# Altium schematic sheet USB2.0_Hub.SchDoc
size A3; SheetNumber: 1; SheetTotal: 4
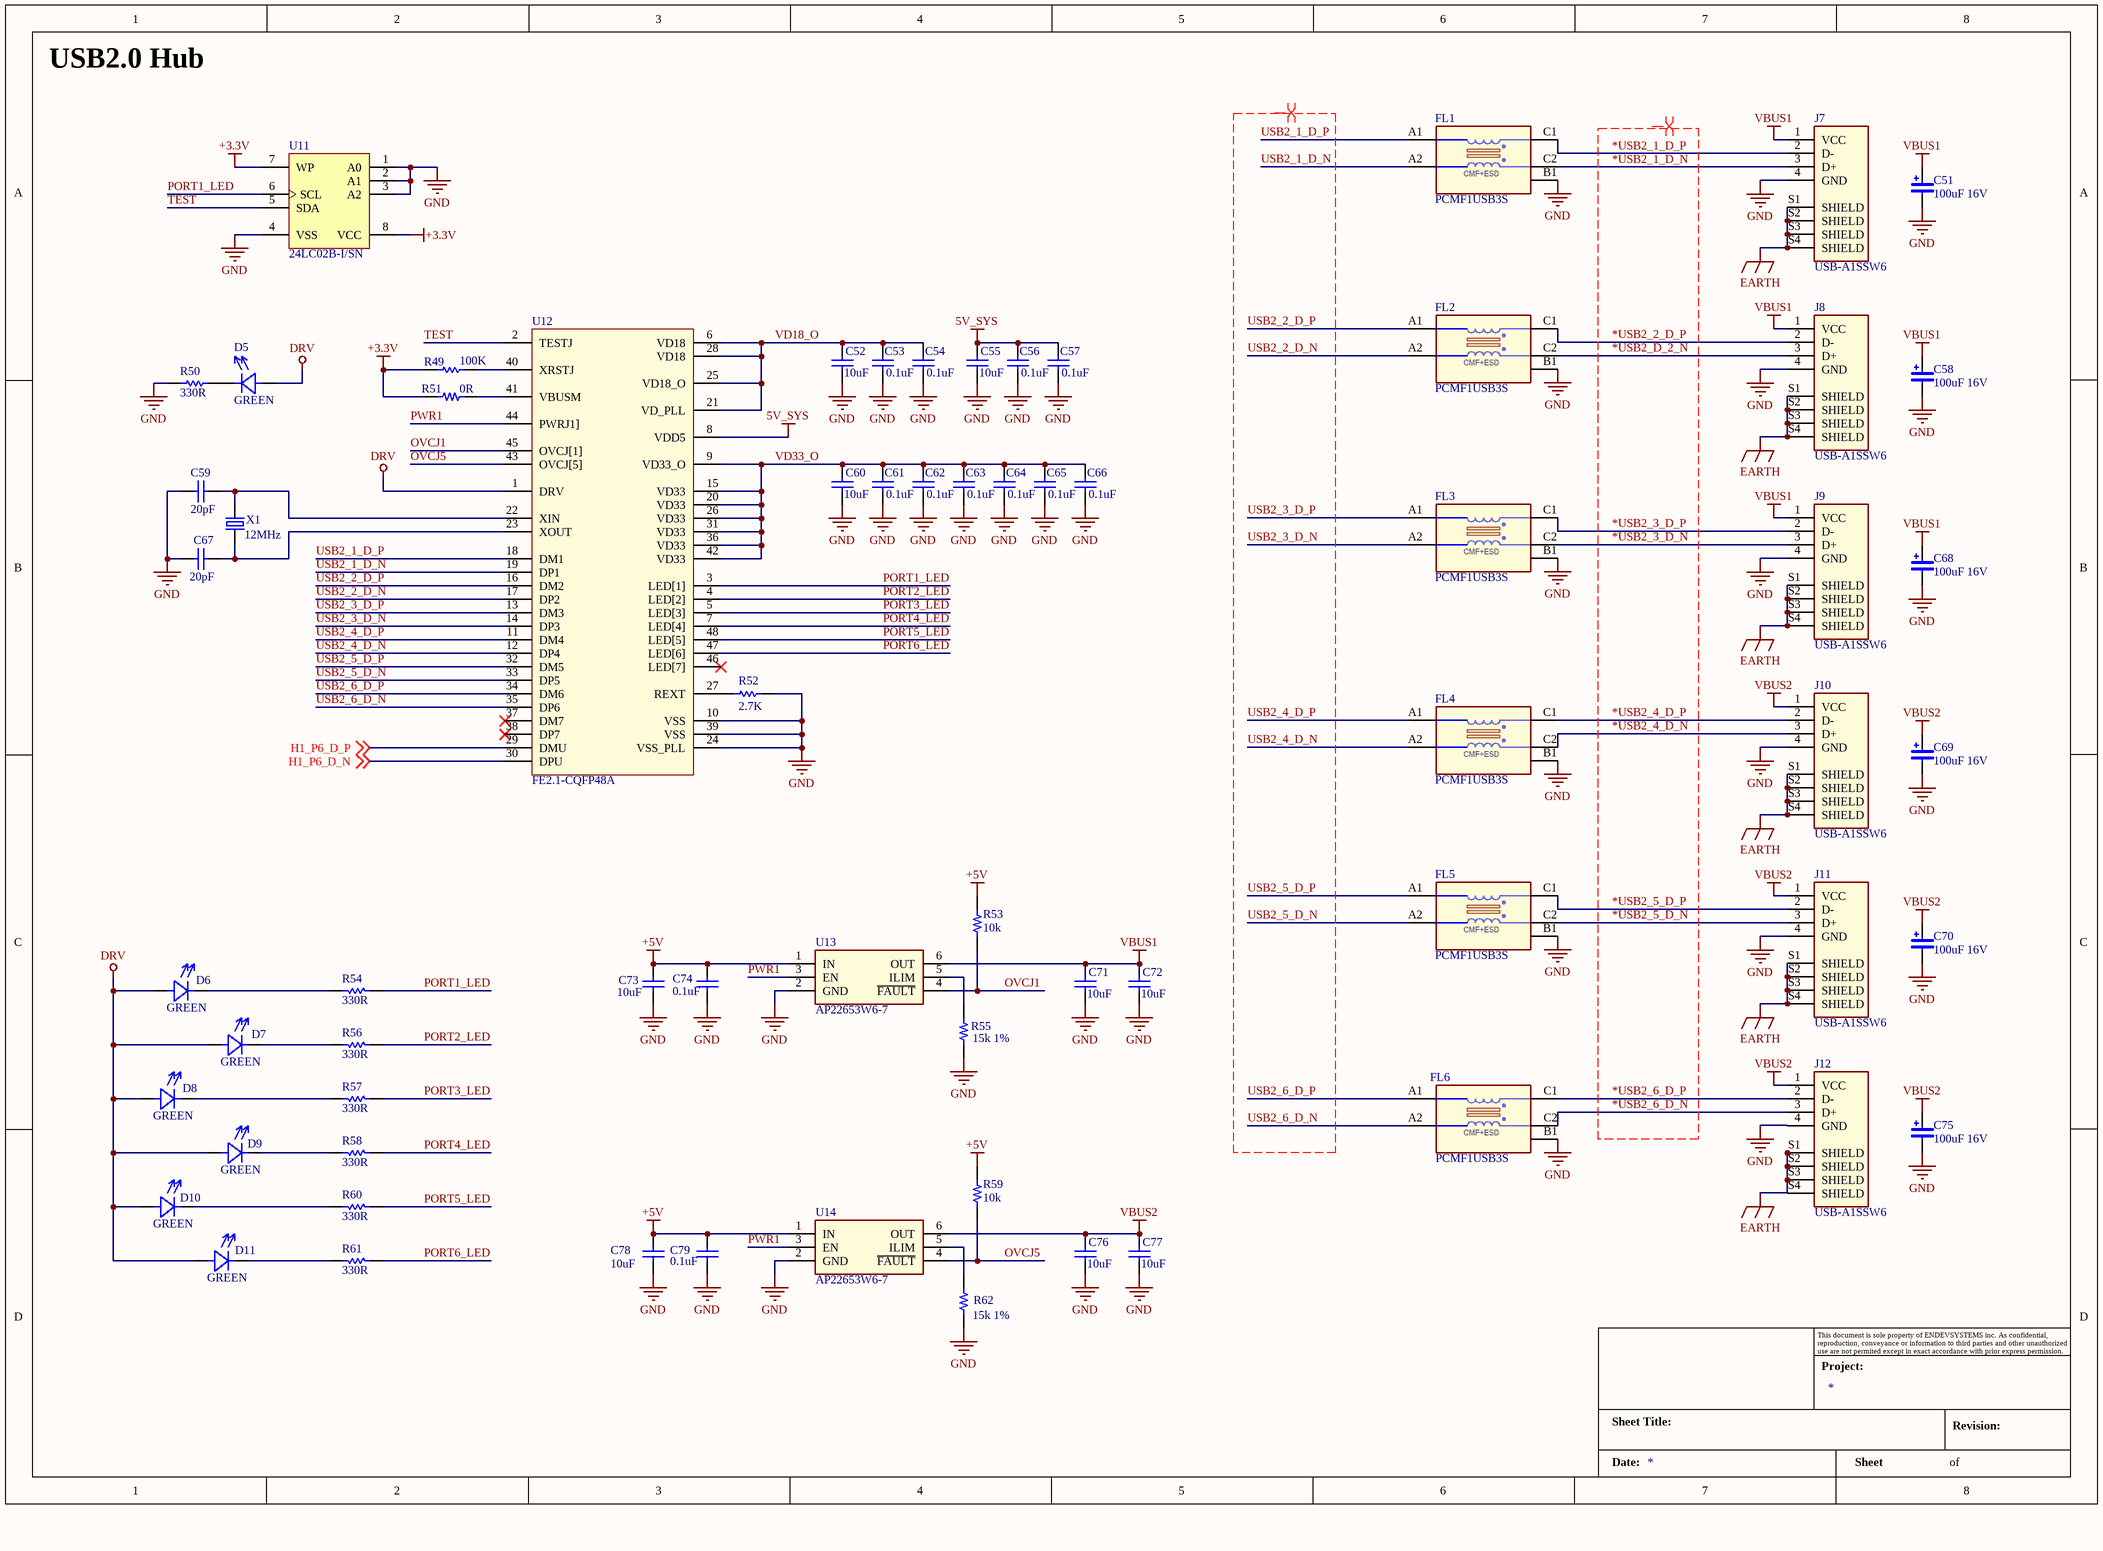
[diagram p0: USB2.0_Hub.SchDoc]

## Parts
?  Title_Block  (value not drawn)  (graphical)
C51  100uF 16V  [CAP-TAN-2312]
C52  10uF  [C-0805/2012]
C53  0.1uF  [C-0402/1005]
C54  0.1uF  [C-0402/1005]
C55  10uF  [C-0805/2012]
C56  0.1uF  [C-0402/1005]
C57  0.1uF  [C-0402/1005]
C58  100uF 16V  [CAP-TAN-2312]
C59  20pF  [R-0402/1005]
C60  10uF  [C-0805/2012]
C61  0.1uF  [C-0402/1005]
C62  0.1uF  [C-0402/1005]
C63  0.1uF  [C-0402/1005]
C64  0.1uF  [C-0402/1005]
C65  0.1uF  [C-0402/1005]
C66  0.1uF  [C-0402/1005]
C67  20pF  [R-0402/1005]
C68  100uF 16V  [CAP-TAN-2312]
C69  100uF 16V  [CAP-TAN-2312]
C70  100uF 16V  [CAP-TAN-2312]
C71  10uF  [C-0805/2012]
C72  10uF  [C-0805/2012]
C73  10uF  [C-0805/2012]
C74  0.1uF  [C-0402/1005]
C75  100uF 16V  [CAP-TAN-2312]
C76  10uF  [C-0805/2012]
C77  10uF  [C-0805/2012]
C78  10uF  [C-0805/2012]
C79  0.1uF  [C-0402/1005]
D5  GREEN  [LEDC1608X65N]
D6  GREEN  [LEDC1608X65N]
D7  GREEN  [LEDC1608X65N]
D8  GREEN  [LEDC1608X65N]
D9  GREEN  [LEDC1608X65N]
D10  GREEN  [LEDC1608X65N]
D11  GREEN  [LEDC1608X65N]
FL1  PCMF1USB3S  [WLCSP5(2-1-2)_NEX]
FL2  PCMF1USB3S  [WLCSP5(2-1-2)_NEX]
FL3  PCMF1USB3S  [WLCSP5(2-1-2)_NEX]
FL4  PCMF1USB3S  [WLCSP5(2-1-2)_NEX]
FL5  PCMF1USB3S  [WLCSP5(2-1-2)_NEX]
FL6  PCMF1USB3S  [WLCSP5(2-1-2)_NEX]
J7  USB-A1SSW6  [ONSHORE_USB-A1SSW6]
J8  USB-A1SSW6  [ONSHORE_USB-A1SSW6]
J9  USB-A1SSW6  [ONSHORE_USB-A1SSW6]
J10  USB-A1SSW6  [ONSHORE_USB-A1SSW6]
J11  USB-A1SSW6  [ONSHORE_USB-A1SSW6]
J12  USB-A1SSW6  [ONSHORE_USB-A1SSW6]
R49  100K  [R-0402/1005]
R50  330R  [R-0402/1005]
R51  0R  [R-0402/1005]
R52  value 2.7K  [R-0402/1005]
R53  10k  [R-0402/1005]
R54  330R  [R-0402/1005]
R55  15k 1%  [R-0402/1005]
R56  330R  [R-0402/1005]
R57  330R  [R-0402/1005]
R58  330R  [R-0402/1005]
R59  10k  [R-0402/1005]
R60  330R  [R-0402/1005]
R61  330R  [R-0402/1005]
R62  15k 1%  [R-0402/1005]
U11  24LC02B-I/SN  [SOIC-SN8_N]
U12  FE2.1-CQFP48A  [PCBComponent_1]
U13  AP22653W6-7  [SOT-23-6]
U14  AP22653W6-7  [SOT-23-6]
X1  12MHz  [HC-49/US]

## Nets
5V_SYS: C55.2 C56.2 C57.2 U12.8(VDD5)
+3.3V: R49.1 R51.1 U11.7(WP) U11.8(VCC)
+5V: C73.2 C74.2 C78.2 C79.2 R53.1 R59.1 U13.1(IN) U14.1(IN)
DRV: D5.A D6.A D7.A D8.A D9.A D10.A D11.A U12.1(DRV)
EARTH: J7.S1(SHIELD) J7.S2(SHIELD) J7.S3(SHIELD) J7.S4(SHIELD) J8.S1(SHIELD) J8.S2(SHIELD) J8.S3(SHIELD) J8.S4(SHIELD) J9.S1(SHIELD) J9.S2(SHIELD) J9.S3(SHIELD) J9.S4(SHIELD) J10.S1(SHIELD) J10.S2(SHIELD) J10.S3(SHIELD) J10.S4(SHIELD) J11.S1(SHIELD) J11.S2(SHIELD) J11.S3(SHIELD) J11.S4(SHIELD) J12.S1(SHIELD) J12.S2(SHIELD) J12.S3(SHIELD)
GND: C51.- C52.1 C53.1 C54.1 C55.1 C56.1 C57.1 C58.- C59.2 C60.1 C61.1 C62.1 C63.1 C64.1 C65.1 C66.1 C67.2 C68.- C69.- C70.- C71.1 C72.1 C73.1 C74.1 C75.- C76.1 C77.1 C78.1 C79.1 FL1.B1(GND) FL2.B1(GND) FL3.B1(GND) FL4.B1(GND) FL5.B1(GND) FL6.B1(GND) J7.4(GND) J8.4(GND) J9.4(GND) J10.4(GND) J11.4(GND) R50.1 R52.2 R55.1 R62.1 U11.1(A0) U11.2(A1) U11.3(A2) U11.4(VSS) U12.10(VSS) U12.24(VSS_PLL) U12.39(VSS) U13.2(GND) U14.2(GND)
VBUS1: C51.+ C58.+ C68.+ C71.2 C72.2 J7.1(VCC) J8.1(VCC) J9.1(VCC) U13.6(OUT)
VBUS2: C69.+ C70.+ C75.+ C76.2 C77.2 J10.1(VCC) J11.1(VCC) J12.1(VCC) U14.6(OUT)
*USB2_2_D_P: FL2.C1(CH1_OUT+) J8.2(D-)
*USB2_3_D_N: FL3.C2(CH1_OUT-) J9.3(D+)
*USB2_3_D_P: FL3.C1(CH1_OUT+) J9.2(D-)
*USB2_4_D_N: FL4.C2(CH1_OUT-) J10.3(D+)
*USB2_4_D_P: FL4.C1(CH1_OUT+) J10.2(D-)
*USB2_5_D_N: FL5.C2(CH1_OUT-) J11.3(D+)
*USB2_5_D_P: FL5.C1(CH1_OUT+) J11.2(D-)
*USB2_6_D_N: FL6.C2(CH1_OUT-) J12.3(D+)
*USB2_6_D_P: FL6.C1(CH1_OUT+) J12.2(D-)
*USB2_D_2_N: FL2.C2(CH1_OUT-) J8.3(D+)
H1_P6_D_N: U12.30(DPU) ; off-sheet H1_P6_D_N
H1_P6_D_P: U12.29(DMU) ; off-sheet H1_P6_D_P
OVCJ1: R53.2 U12.45(OVCJ[1]) U13.4(~{FAULT})
OVCJ5: R59.2 U12.43(OVCJ[5]) U14.4(~{FAULT})
PORT1_LED: R54.1 U11.6(SCL) U12.3(LED[1])
PORT2_LED: R56.1 U12.4(LED[2])
PORT3_LED: R57.1 U12.5(LED[3])
PORT4_LED: R58.1 U12.7(LED[4])
PORT5_LED: R60.1 U12.48(LED[5])
PORT6_LED: R61.1 U12.47(LED[6])
PWR1: U12.44(PWRJ1]) U13.3(EN) U14.3(EN)
TEST: U11.5(SDA) U12.2(TESTJ)
USB2_1_D_N: FL1.A2(CH1_IN-) U12.19(DP1)
USB2_1_D_P: FL1.A1(CH1_IN+) U12.18(DM1)
USB2_2_D_N: FL2.A2(CH1_IN-) U12.17(DP2)
USB2_2_D_P: FL2.A1(CH1_IN+) U12.16(DM2)
USB2_3_D_N: FL3.A2(CH1_IN-) U12.14(DP3)
USB2_3_D_P: FL3.A1(CH1_IN+) U12.13(DM3)
USB2_4_D_N: FL4.A2(CH1_IN-) U12.12(DP4)
USB2_4_D_P: FL4.A1(CH1_IN+) U12.11(DM4)
USB2_5_D_N: FL5.A2(CH1_IN-) U12.33(DP5)
USB2_5_D_P: FL5.A1(CH1_IN+) U12.32(DM5)
USB2_6_D_N: FL6.A2(CH1_IN-) U12.35(DP6)
USB2_6_D_P: FL6.A1(CH1_IN+) U12.34(DM6)
VD18_O: C52.2 C53.2 C54.2 U12.6(VD18) U12.21(VD_PLL) U12.25(VD18_O) U12.28(VD18)
VD33_O: C60.2 C61.2 C62.2 C63.2 C64.2 C65.2 C66.2 U12.9(VD33_O) U12.15(VD33) U12.20(VD33) U12.26(VD33) U12.31(VD33) U12.36(VD33) U12.42(VD33)
NetC59_1: C59.1 U12.22(XIN) X1.2
NetC67_1: C67.1 U12.23(XOUT) X1.1
NetD5_C: D5.C R50.2
NetD6_C: D6.C R54.2
NetD7_C: D7.C R56.2
NetD8_C: D8.C R57.2
NetD9_C: D9.C R58.2
NetD10_C: D10.C R60.2
NetD11_C: D11.C R61.2
NetFL1_C1: FL1.C1(CH1_OUT+) J7.2(D-)
NetFL1_C2: FL1.C2(CH1_OUT-) J7.3(D+)
NetR49_2: R49.2 U12.40(XRSTJ)
NetR51_2: R51.2 U12.41(VBUSM)
NetR52_1: R52.1 U12.27(REXT)
NetR55_2: R55.2 U13.5(ILIM)
NetR62_2: R62.2 U14.5(ILIM)

Not connected (* = marked no-connect by the designer): J12 4(GND) S4(SHIELD); U12 37(DM7)* 38(DP7)* 46(LED[7])*

## Layout directives
differential pair; differential pair class Diff_90R: (no net found under the mark), USB2_1_D_N, USB2_1_D_P, USB2_2_D_N, USB2_2_D_P, USB2_3_D_N, USB2_3_D_P, USB2_4_D_N, USB2_4_D_P, USB2_5_D_N, USB2_5_D_P, USB2_6_D_N, USB2_6_D_P

## Notes on the sheet
- USB2.0 Hub
- Labels drawn without touching a wire or pin: *USB2_1_D_N, *USB2_1_D_P
- (in symbol Nexperia, PCMF1USB3SZ) CMF+ESD
- (in symbol Title_Block) This document is sole property of ENDEVSYSTEMS inc. As confidential, reproduction, conveyance or information to third parties and other unauthorized use are not permited except in exact accordance with prior express permission.; Project:; Sheet Title:; Revision:; Date:; Sheet; of

## Library data of the parts
C51 C58 C68-C70 C75 = Capacitor-Polar: CAP TANT 10UF 10% 16V 1206; Mfr. Part No.: F931C106KAAAJ6; Unit Price (USD): 0.67; Value: 10uF 16V; Supplier Part No.: 478-10723-1-ND; Supplier: Digikey Electronics
C52-C57 C60-C66 C71-C74 C76-C79 = Cap: Capacitor; Published: 8-Jun-2000; LatestRevisionDate: 17-Jul-2002; LatestRevisionNote: Re-released for DXP Platform.; PackageReference: RAD-0.3; Publisher: Altium Limited; PackageDescription: Radial Cap, Thru-Hole; 2 Leads; 0.3 in Pin Spacing
  C52 C55 C60 C71-C73 C76-C78: Value: 10uF
  C53 C54 C56 C57 C61-C66 C74 C79: Value: 0.1uF
C59 C67 = Cap: Capacitor; Value: 0.1uF; Published: 8-Jun-2000; LatestRevisionDate: 17-Jul-2002; LatestRevisionNote: Re-released for DXP Platform.; PackageReference: RAD-0.3; Publisher: Altium Limited; PackageDescription: Radial Cap, Thru-Hole; 2 Leads; 0.3 in Pin Spacing
D5-D11 = Diode-LED: Supplier: Digikey Electronics
FL1-FL6 = Nexperia, PCMF1USB3SZ: FLT, SMT, WLCSP5, Common Mode EMI Filters; Supply Voltage: NO; Notes: NC; Value: PCMF1USB3S; Manufacturer: Nexperia; Mounting: SMT; Operating Temperature: -40ºC ~ +125ºC; Subpart Type: Common Mode EMI Filters; Footprint: WLCSP5; Manufacturer Part Number: PCMF1USB3S; Datasheet Link: https://www.nexperia.com/products/esd-protection-tvs-filtering-and-signal-conditioning/emi-solutions-with-integrated-protection/common-mode-filters-with-integrated-protection/PCMF1USB3S.html; Supply Current: NO; Substitutes Allowed: NO; Height: 0.6mm
J7-J12 = USB-A1SSW6: USB-A (USB TYPE-A) - Receptacle Connector 4 Position Through Hole, Right Angle; MF: On Shore; Value: *; SnapEDA_Link: https://www.snapeda.com/parts/USB-A1SSW6/On+Shore+Technology+Inc./view-part/?ref=snap; Purchase-URL: https://pricing.snapeda.com/search/part/USB-A1SSW6/?ref=eda; Availability: In Stock; Price: None; Package: None; Check_prices: https://www.snapeda.com/parts/USB-A1SSW6/On+Shore+Technology+Inc./view-part/?ref=eda; MP: USB-A1SSW6
R49 R50 R54 R56-R58 R60 R61 = Res1: Resistor; Value: 10K; Published: 8-Jun-2000; LatestRevisionDate: 17-Jul-2002; LatestRevisionNote: Re-released for DXP Platform.; PackageReference: AXIAL-0.3; Publisher: Altium Limited; PackageDescription: Axial Device, Thru-Hole; 2 Leads; 0.3 in Pin Spacing
R51 = Resistor: RES SMD 2.2K OHM 1% 1/16W 0402; Mfr. Part No.: RT0402FRE072K2L; Value: 2.2k 1%; Unit Price (USD): 0.1; Supplier Part No.: 13-RT0402FRE072K2LCT-ND; Supplier: Digikey Electronics
R52 = Res1: Resistor; Published: 8-Jun-2000; LatestRevisionDate: 17-Jul-2002; LatestRevisionNote: Re-released for DXP Platform.; PackageReference: AXIAL-0.3; Publisher: Altium Limited; PackageDescription: Axial Device, Thru-Hole; 2 Leads; 0.3 in Pin Spacing
R53 R59 = Resistor: RES SMD 1K OHM 1% 1/16W 0402; Mfr. Part No.: RC0402FR-071KL; Unit Price (USD): 0.1; Value: 1k; Supplier Part No.: 311-1.00KLRCT-ND; Supplier: Digikey Electronics
R55 R62 = Resistor: RES SMD 15K OHM 1% 1/16W 0402; Mfr. Part No.: MCR01MZPF1502; Unit Price (USD): 0.1; Value: 15k 1%; Supplier Part No.: RHM15.0KLTR-ND; Supplier: Digikey Electronics
U11 = CMP-0159-00332-1: 2Kbit, 400kHz, 2.5V, I2C Serial EEPROM, 8-Pin SOIC 150mil, Industrial Temperature; PackageReference: SOIC-SN8; Code_JEDEC: MS-012; DatasheetVersion: revJ, Feb-2009; Code_IPC: SOIC127P600-8; PackageVersion: revBB, Aug-2009; PackageDescription: 8-Lead Plastic Small Outline (SN) - Narrow, 3.90mm Body [SOIC]
U12 = FE2.1-CQFP48A: LQFP-48(7x7) USB ICs ROHS
U13 U14 = AP22653W6-7: LOAD SWITCH,SOT26,T&R,3K; Unit Price (USD): 0.42; Supplier Part No.: 31-AP22653W6-7CT-ND; Mfr. Part No.: AP22653W6-7; Supplier: Digikey Electronics
X1 = ST3215SB32768C0HPWBB: CRYSTAL 24.0000MHZ 18PF TH; Mfr. Part No.: ECS-240-18-4XEN; Unit Price (USD): 0.66; Supplier: Digikey Electronics; Supplier Part No.: XC1725-ND
? = Title_Block: Date:: *; Project:: *